# Altium schematic sheet led7Seg_2.SchDoc
size A4
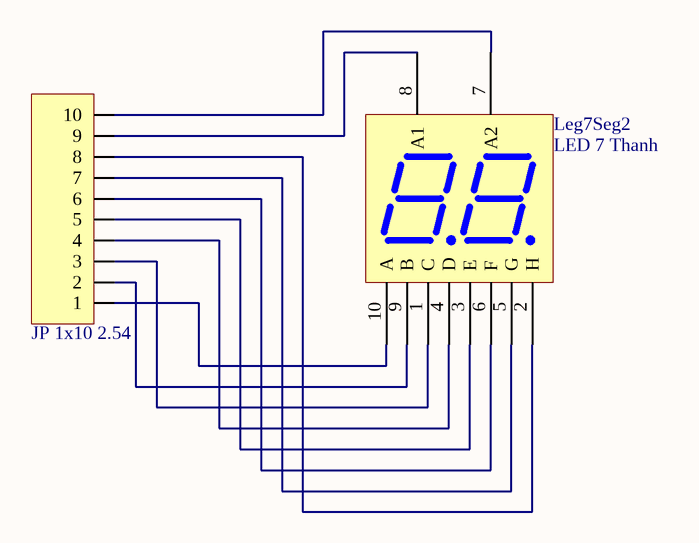
[diagram p0: led7Seg_2.SchDoc]

## Parts
JP10  JP 1x10 2.54  [JP 1x10 DT]
Leg7Seg2  LED 7 Thanh  [LED 7x2 0.56]

## Nets
NetJP10_1: JP10.1 Leg7Seg2.10(A)
NetJP10_2: JP10.2 Leg7Seg2.9(B)
NetJP10_3: JP10.3 Leg7Seg2.1(C)
NetJP10_4: JP10.4 Leg7Seg2.4(D)
NetJP10_5: JP10.5 Leg7Seg2.3(E)
NetJP10_6: JP10.6 Leg7Seg2.6(F)
NetJP10_7: JP10.7 Leg7Seg2.5(G)
NetJP10_8: JP10.8 Leg7Seg2.2(H)
NetJP10_9: JP10.9 Leg7Seg2.8(A1)
NetJP10_10: JP10.10 Leg7Seg2.7(A2)

## Library data of the parts
JP10 = JP 1x10 2.54 Duc Thang: Cắm; Ten_Linh_Kien: Jump Đơn Đực 2.54MM 1x40P Thẳng 11MM; Don_Vi: Con; Ma_Hang: MH000903; Ghi_Chu: *; Kieu_Chan: *; Chung_Loai: Cắm
Leg7Seg2 = LED 7x2 0.56 Anot: Dán; Don_Vi: Con; Ma_Hang: MH001040; Ten_Linh_Kien: Led 7 0.56 2 Số Anot (Sáng Đỏ; Ghi_Chu: *; Kieu_Chan: *; Chung_Loai: Dán